# Altium schematic sheet LED.SchDoc
size 420 x 297 mm; Revision: 1.1.0; SheetNumber: 14; SheetTotal: 15
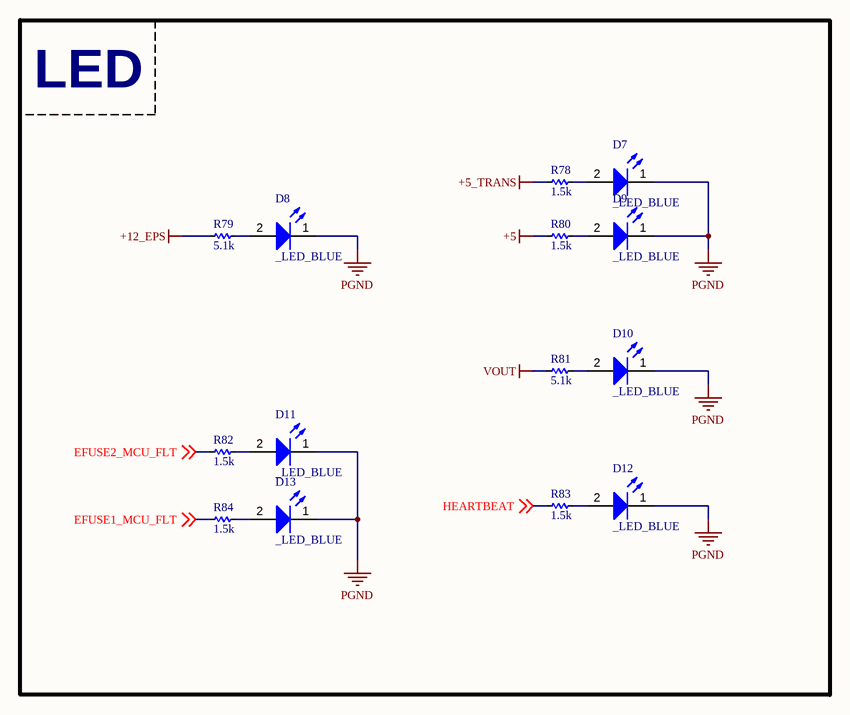
[diagram p0: LED.SchDoc]

## Parts
D7  _LED_BLUE  [LED_0603]
D8  _LED_BLUE  [LED_0603]
D9  _LED_BLUE  [LED_0603]
D10  _LED_BLUE  [LED_0603]
D11  _LED_BLUE  [LED_0603]
D12  _LED_BLUE  [LED_0603]
D13  _LED_BLUE  [LED_0603]
R78  1.5k  [RES_C_1608X60]
R79  5.1k  [RES_C_1608X60]
R80  1.5k  [RES_C_1608X60]
R81  5.1k  [RES_C_1608X60]
R82  1.5k  [RES_C_1608X60]
R83  1.5k  [RES_C_1608X60]
R84  1.5k  [RES_C_1608X60]

## Blocks framed on the sheet
LED: D7-D13 R78-R84

## Nets
+5: R80.2
+5_TRANS: R78.2
+12_EPS: R79.2
PGND: D7.1(K) D8.1(K) D9.1(K) D10.1(K) D11.1(K) D12.1(K) D13.1(K)
VOUT: R81.2
EFUSE1_MCU_FLT: R84.2 ; off-sheet EFUSE1_MCU_FLT
EFUSE2_MCU_FLT: R82.2 ; off-sheet EFUSE2_MCU_FLT
HEARTBEAT: R83.2 ; off-sheet HEARTBEAT
NetD7_2: D7.2(A) R78.1
NetD8_2: D8.2(A) R79.1
NetD9_2: D9.2(A) R80.1
NetD10_2: D10.2(A) R81.1
NetD11_2: D11.2(A) R82.1
NetD12_2: D12.2(A) R83.1
NetD13_2: D13.2(A) R84.1

## Notes on the sheet
- Project:
- DAL_PDU
- Sub-system:
- IGRVT-50
- Design by:
- KIEN HOANG
- BAO BUI
- Sheet title:
- Sheet
- A3
- of
- Checked by:
- Approved by:
- VU PHAM
- Revision:
- Document No:
- Size:
- Date:

## Library data of the parts
R78-R84 = _RES_B_2_2: RES